# EAGLE design 01 (EAGLE 7.2.0)
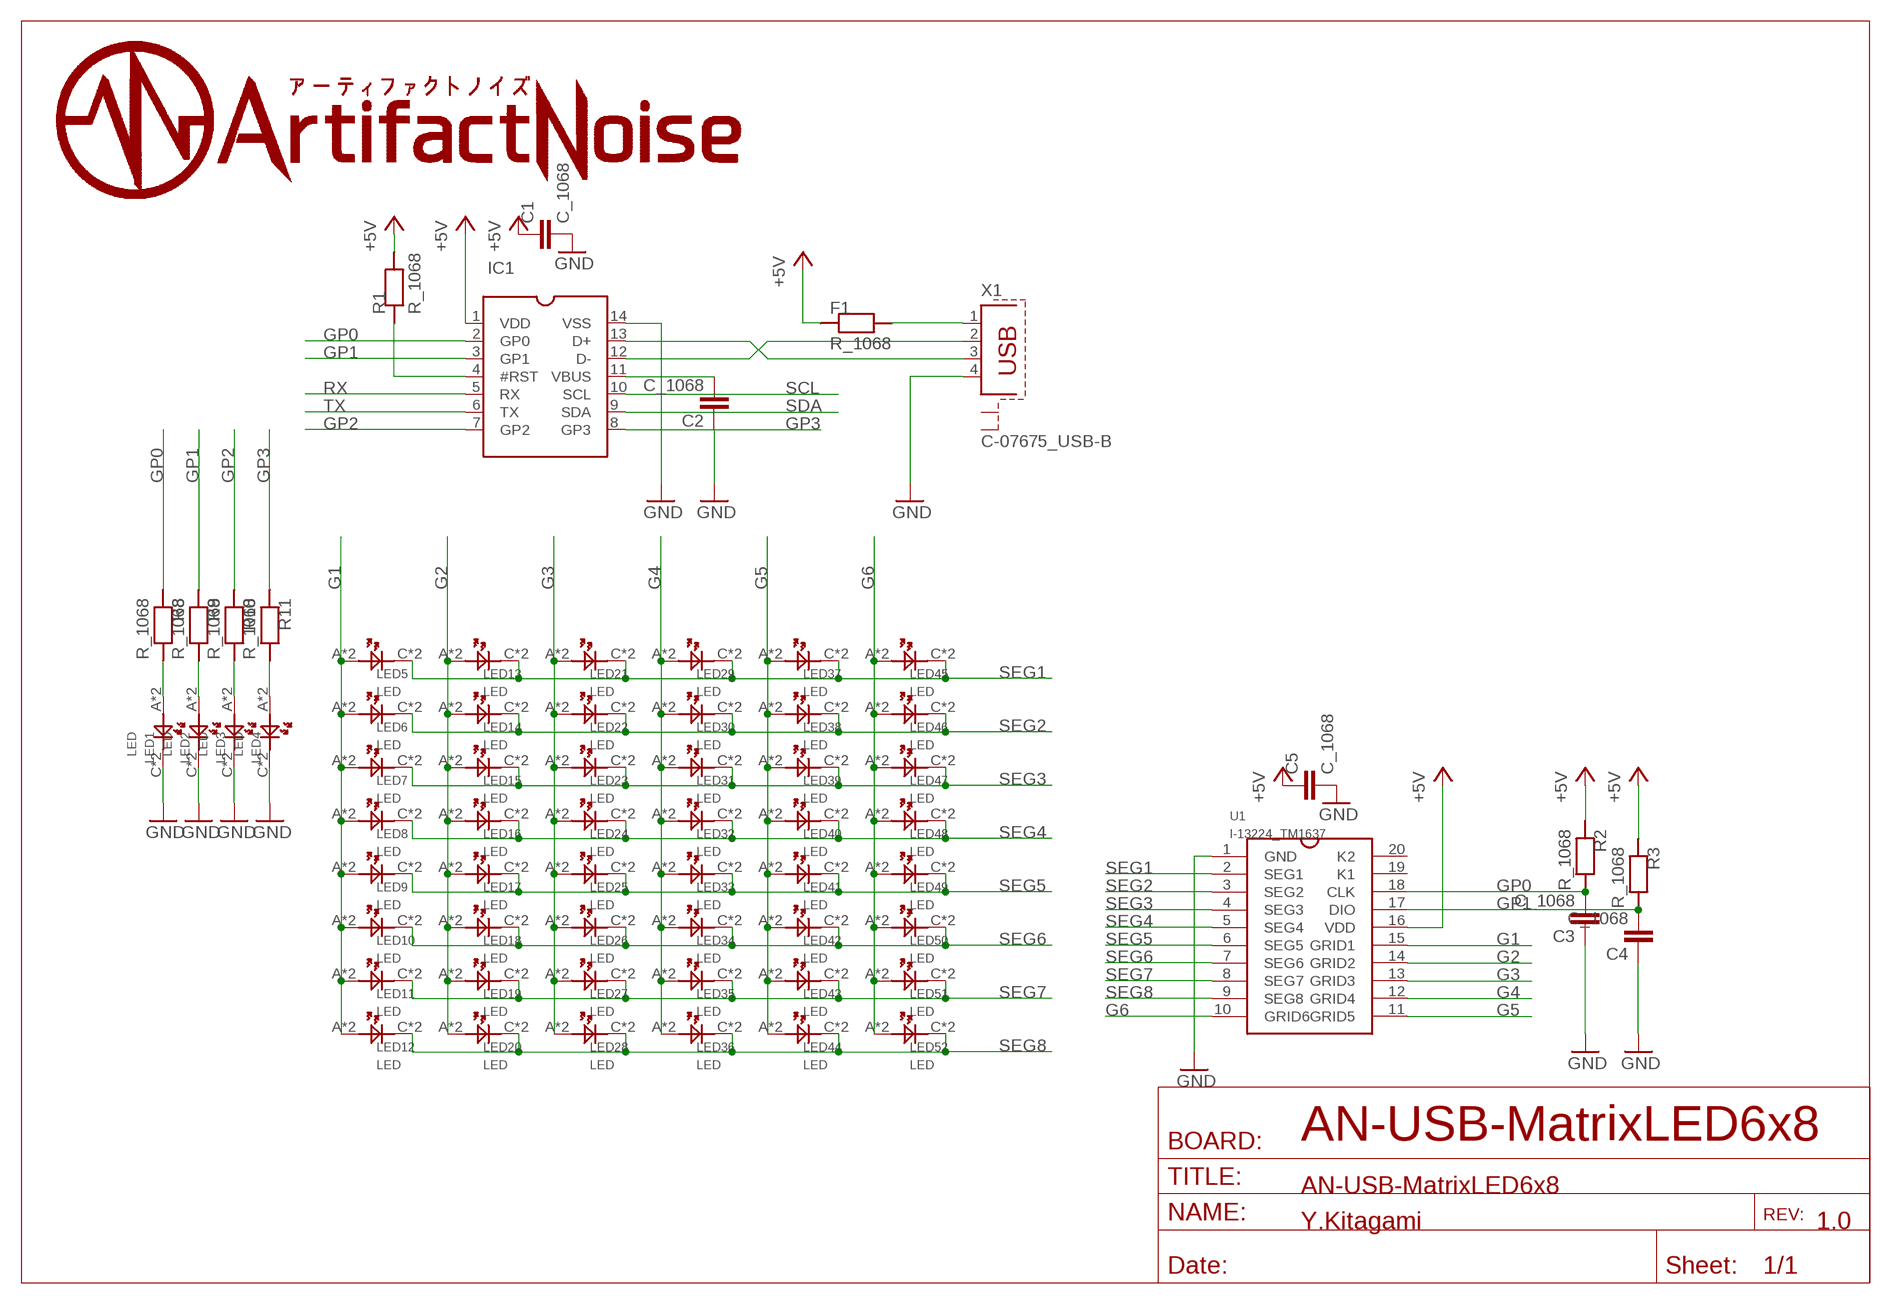
[diagram p0: schematic, sheet 1]

## Parts
C1  C_1068  [C0603]
C2  C_1068  [C0603]
C3  C_1068  [C0603]
C4  C_1068  [C0603]
C5  C_1068  [C0603]
F1  R_1068  [R0603]
IC1  _MCP2221A-I/PS  [SOCKET-14]
LED1  LED  [5MM_LED]
LED2  LED  [5MM_LED]
LED3  LED  [5MM_LED]
LED4  LED  [5MM_LED]
LED5  LED  [5MM_LED]
LED6  LED  [5MM_LED]
LED7  LED  [5MM_LED]
LED8  LED  [5MM_LED]
LED9  LED  [5MM_LED]
LED10  LED  [5MM_LED]
LED11  LED  [5MM_LED]
LED12  LED  [5MM_LED]
LED13  LED  [5MM_LED]
LED14  LED  [5MM_LED]
LED15  LED  [5MM_LED]
LED16  LED  [5MM_LED]
LED17  LED  [5MM_LED]
LED18  LED  [5MM_LED]
LED19  LED  [5MM_LED]
LED20  LED  [5MM_LED]
LED21  LED  [5MM_LED]
LED22  LED  [5MM_LED]
LED23  LED  [5MM_LED]
LED24  LED  [5MM_LED]
LED25  LED  [5MM_LED]
LED26  LED  [5MM_LED]
LED27  LED  [5MM_LED]
LED28  LED  [5MM_LED]
LED29  LED  [5MM_LED]
LED30  LED  [5MM_LED]
LED31  LED  [5MM_LED]
LED32  LED  [5MM_LED]
LED33  LED  [5MM_LED]
LED34  LED  [5MM_LED]
LED35  LED  [5MM_LED]
LED36  LED  [5MM_LED]
LED37  LED  [5MM_LED]
LED38  LED  [5MM_LED]
LED39  LED  [5MM_LED]
LED40  LED  [5MM_LED]
LED41  LED  [5MM_LED]
LED42  LED  [5MM_LED]
LED43  LED  [5MM_LED]
LED44  LED  [5MM_LED]
LED45  LED  [5MM_LED]
LED46  LED  [5MM_LED]
LED47  LED  [5MM_LED]
LED48  LED  [5MM_LED]
LED49  LED  [5MM_LED]
LED50  LED  [5MM_LED]
LED51  LED  [5MM_LED]
LED52  LED  [5MM_LED]
R1  R_1068  [R0603]
R2  R_1068  [R0603]
R3  R_1068  [R0603]
R8  R_1068  [R0603]
R9  R_1068  [R0603]
R10  R_1068  [R0603]
R11  R_1068  [R0603]
U1  I-13224_TM1637  [DIL20]
X1  C-07675_USB-B  [PN61729-S]

## Nets
+5V: C1.1 C1.D1 C5.1 C5.D1 F1.1 F1.D1 IC1.1(VDD) R1.2 R1.D2 R2.1 R2.D1 R3.1 R3.D1 U1.16(VDD)
G1: LED5.A LED5.DA(A) LED6.A LED6.DA(A) LED7.A LED7.DA(A) LED8.A LED8.DA(A) LED9.A LED9.DA(A) LED10.A LED10.DA(A) LED11.A LED11.DA(A) LED12.A LED12.DA(A) U1.15(GRID1)
G2: LED13.A LED13.DA(A) LED14.A LED14.DA(A) LED15.A LED15.DA(A) LED16.A LED16.DA(A) LED17.A LED17.DA(A) LED18.A LED18.DA(A) LED19.A LED19.DA(A) LED20.A LED20.DA(A) U1.14(GRID2)
G3: LED21.A LED21.DA(A) LED22.A LED22.DA(A) LED23.A LED23.DA(A) LED24.A LED24.DA(A) LED25.A LED25.DA(A) LED26.A LED26.DA(A) LED27.A LED27.DA(A) LED28.A LED28.DA(A) U1.13(GRID3)
G4: LED29.A LED29.DA(A) LED30.A LED30.DA(A) LED31.A LED31.DA(A) LED32.A LED32.DA(A) LED33.A LED33.DA(A) LED34.A LED34.DA(A) LED35.A LED35.DA(A) LED36.A LED36.DA(A) U1.12(GRID4)
G5: LED37.A LED37.DA(A) LED38.A LED38.DA(A) LED39.A LED39.DA(A) LED40.A LED40.DA(A) LED41.A LED41.DA(A) LED42.A LED42.DA(A) LED43.A LED43.DA(A) LED44.A LED44.DA(A) U1.11(GRID5)
G6: LED45.A LED45.DA(A) LED46.A LED46.DA(A) LED47.A LED47.DA(A) LED48.A LED48.DA(A) LED49.A LED49.DA(A) LED50.A LED50.DA(A) LED51.A LED51.DA(A) LED52.A LED52.DA(A) U1.10(GRID6)
GND: C1.2 C1.D2 C2.1 C2.D1 C3.1 C3.D1 C4.1 C4.D1 C5.2 C5.D2 IC1.14(VSS) LED1.C LED1.DC(C) LED2.C LED2.DC(C) LED3.C LED3.DC(C) LED4.C LED4.DC(C) U1.1(GND) X1.4
GP0: C3.2 C3.D2 IC1.2(GP0) R2.2 R2.D2 R8.1 R8.D1 U1.18(CLK)
GP1: C4.2 C4.D2 IC1.3(GP1) R3.2 R3.D2 R9.1 R9.D1 U1.17(DIO)
GP2: IC1.7(GP2) R10.1 R10.D1
GP3: IC1.8(GP3) R11.1 R11.D1
N$1: IC1.4(#RST) R1.1 R1.D1
N$2: IC1.13(D+) X1.3
N$3: IC1.12(D-) X1.2
N$4: C2.2 C2.D2 IC1.11(VBUS)
N$5: F1.2 F1.D2 X1.1
N$9: LED1.A LED1.DA(A) R8.2 R8.D2
N$10: LED2.A LED2.DA(A) R9.2 R9.D2
N$11: LED3.A LED3.DA(A) R10.2 R10.D2
N$12: LED4.A LED4.DA(A) R11.2 R11.D2
RX: IC1.5(RX)
SCL: IC1.10(SCL)
SDA: IC1.9(SDA)
SEG1: LED5.C LED5.DC(C) LED13.C LED13.DC(C) LED21.C LED21.DC(C) LED29.C LED29.DC(C) LED37.C LED37.DC(C) LED45.C LED45.DC(C) U1.2(SEG1)
SEG2: LED6.C LED6.DC(C) LED14.C LED14.DC(C) LED22.C LED22.DC(C) LED30.C LED30.DC(C) LED38.C LED38.DC(C) LED46.C LED46.DC(C) U1.3(SEG2)
SEG3: LED7.C LED7.DC(C) LED15.C LED15.DC(C) LED23.C LED23.DC(C) LED31.C LED31.DC(C) LED39.C LED39.DC(C) LED47.C LED47.DC(C) U1.4(SEG3)
SEG4: LED8.C LED8.DC(C) LED16.C LED16.DC(C) LED24.C LED24.DC(C) LED32.C LED32.DC(C) LED40.C LED40.DC(C) LED48.C LED48.DC(C) U1.5(SEG4)
SEG5: LED9.C LED9.DC(C) LED17.C LED17.DC(C) LED25.C LED25.DC(C) LED33.C LED33.DC(C) LED41.C LED41.DC(C) LED49.C LED49.DC(C) U1.6(SEG5)
SEG6: LED10.C LED10.DC(C) LED18.C LED18.DC(C) LED26.C LED26.DC(C) LED34.C LED34.DC(C) LED42.C LED42.DC(C) LED50.C LED50.DC(C) U1.7(SEG6)
SEG7: LED11.C LED11.DC(C) LED19.C LED19.DC(C) LED27.C LED27.DC(C) LED35.C LED35.DC(C) LED43.C LED43.DC(C) LED51.C LED51.DC(C) U1.8(SEG7)
SEG8: LED12.C LED12.DC(C) LED20.C LED20.DC(C) LED28.C LED28.DC(C) LED36.C LED36.DC(C) LED44.C LED44.DC(C) LED52.C LED52.DC(C) U1.9(SEG8)
TX: IC1.6(TX)
Unconnected: U1.19(K1) U1.20(K2) X1.S1 X1.S2

## Notes on the sheet
- AN-USB-MatrixLED6x8
- AN-USB-MatrixLED6x8
- Y.Kitagami | 1.0

## Library data of the parts
C1-C5 = 01:C_1068
F1 R1-R3 R8-R11 = 01:R_1068
IC1 = 01:_MCP2221A-I/P: Dual In Line / Socket
LED1-LED52 = 01:LED
U1 = 01:I-13224_TM1637
X1 = 01:C-07675_USB-B: BERG USB connector; OC_FARNELL: unknown; OC_NEWARK: unknown

## Board
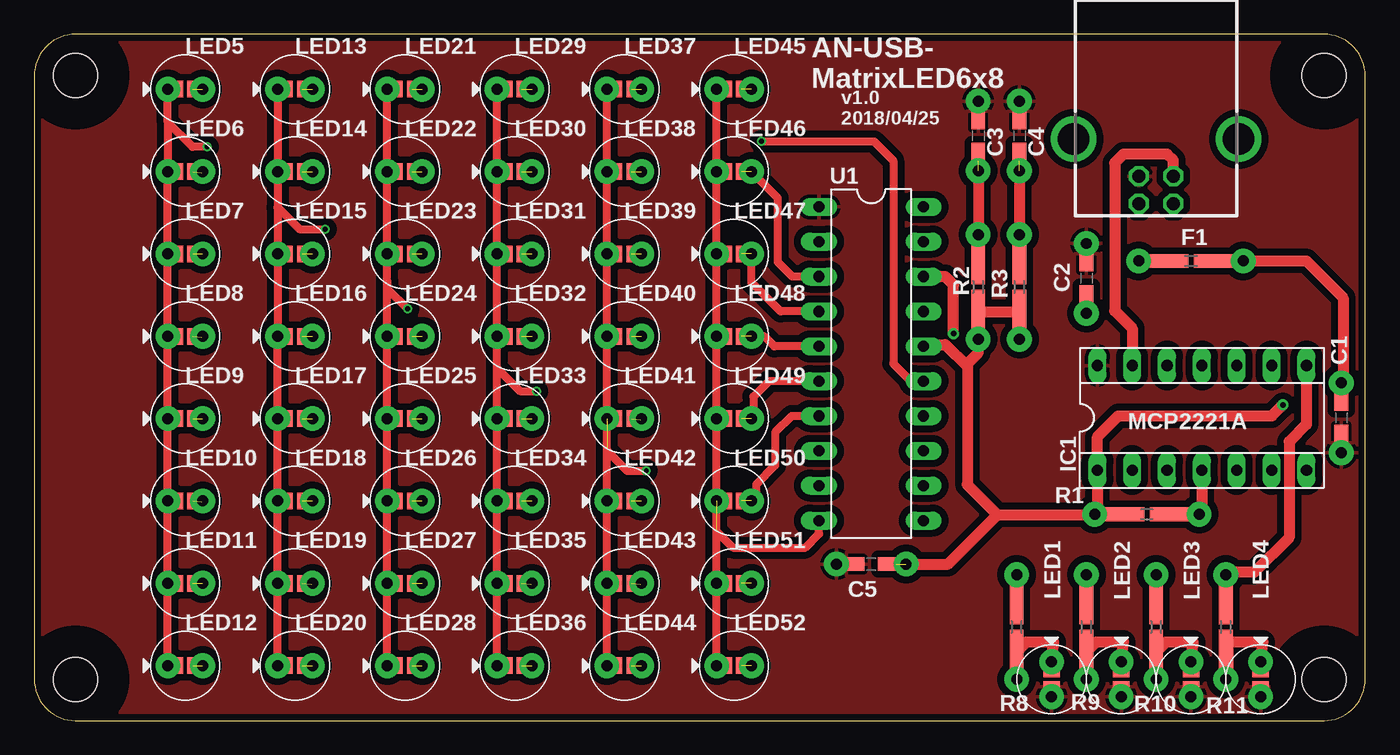
[diagram p1: board, top side]
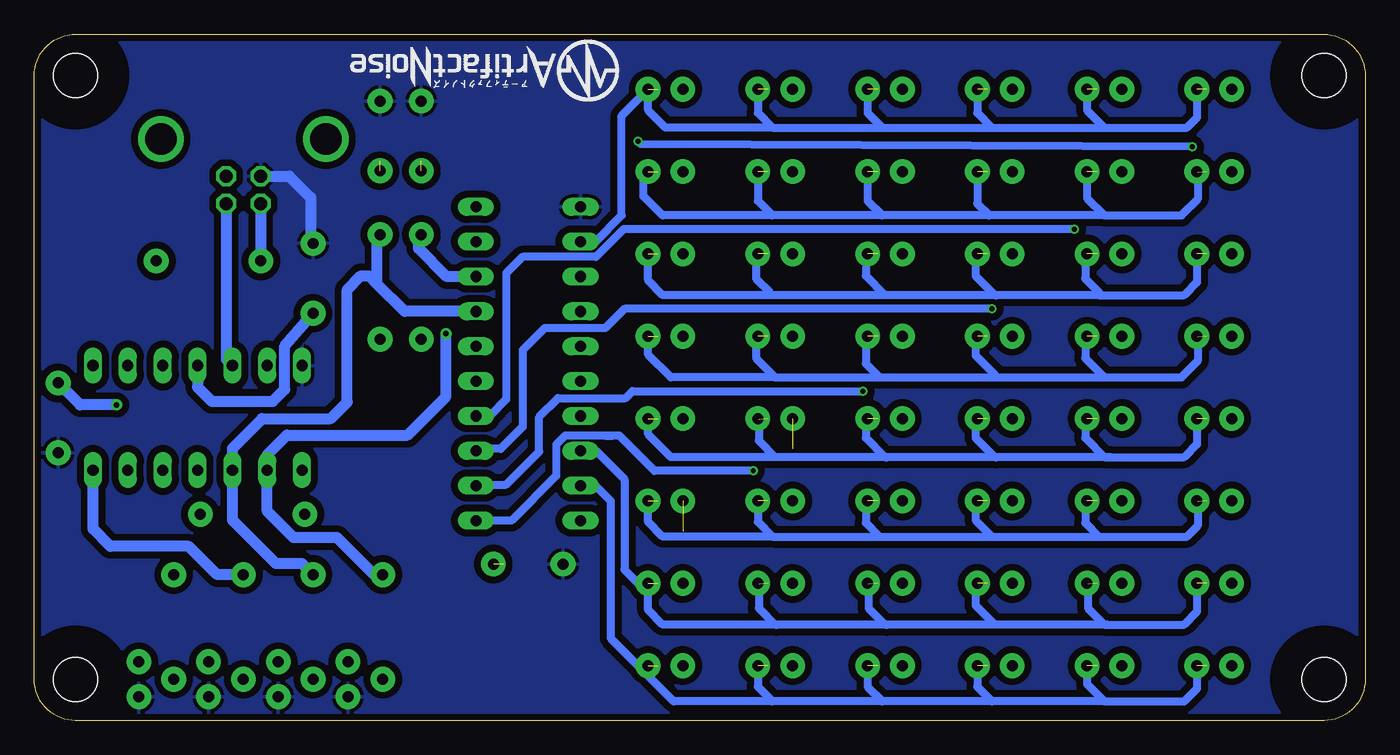
[diagram p2: board, bottom side, seen from below]

Size 97 x 50 mm. Coordinates in mm from the lower left corner, seen from the top.
Outline: 97,3 97,47 arc90 94,50 3,50 arc90 0,47 0,3 arc90 3,0 94,0 arc90 97,3
Copper layers (1*16): Top 0.035mm / dielectric 1.5mm / Bottom 0.035mm
Design rules "SeeedStudio_2layer_DRU_no_angle_20140221a": minimum track width 6mil, minimum drill 12mil, track to track 6mil, track to pad 6mil, pad to pad 6mil, via to via 6mil, smd to smd 0mil, copper to edge 10mil, drill to drill 10mil, minimum pad ring 10mil, minimum via ring 6mil, stop-mask expansion 2mil, vias tented up to drill 25mil, thermal gap 10mil
Holes 3.2 mm at 94,47 3,47 3,3 94,3
tRestrict: area -0.2,43.8 to 6.2,50.2; area -0.2,-0.2 to 6.2,6.2; area 90.8,-0.2 to 97.2,6.2; area 90.8,43.8 to 97.2,50.2
bRestrict: area -0.2,43.8 to 6.2,50.2; area -0.2,-0.2 to 6.2,6.2; area 90.8,-0.2 to 97.2,6.2; area 90.8,43.8 to 97.2,50.2

### Footprints (pad centres in the part's own frame; a part is rotated, then mirrored left to right if it is on the bottom)
C0603 = smd 2.6 x 1: 1 -1.8,0; 2 1.8,0 | drill 0.8 pad 1.8: D1 -2.54,0; D2 2.54,0
R0603 = smd 3.2 x 1: 1 -1.8,0; 2 1.8,0 | drill 0.8 pad 1.8: D1 -3.81,0; D2 3.81,0
SOCKET-14 = drill 0.813 long: 1 -7.62,-3.81; 2 -5.08,-3.81; 3 -2.54,-3.81; 4 0,-3.81; 5 2.54,-3.81; 6 5.08,-3.81; 7 7.62,-3.81; 8 7.62,3.81; 9 5.08,3.81; 10 2.54,3.81; 11 0,3.81; 12 -2.54,3.81; 13 -5.08,3.81; 14 -7.62,3.81
5MM_LED = smd 1.2 x 0.75: A 0,-0.53; C 0,0.53 | drill 0.8 pad 1.8: DA 0,-1.27; DC 0,1.27
DIL20 = drill 0.813 long: 1 -11.43,-3.81; 2 -8.89,-3.81; 3 -6.35,-3.81; 4 -3.81,-3.81; 5 -1.27,-3.81; 6 1.27,-3.81; 7 3.81,-3.81; 8 6.35,-3.81; 9 8.89,-3.81; 10 11.43,-3.81; 11 11.43,3.81; 12 8.89,3.81; 13 6.35,3.81; 14 3.81,3.81; 15 1.27,3.81; 16 -1.27,3.81; 17 -3.81,3.81; 18 -6.35,3.81; 19 -8.89,3.81; 20 -11.43,3.81
PN61729-S = drill 0.95 octagon: 1 1.25,4.71; 2 -1.25,4.71; 3 -1.25,2.71; 4 1.25,2.71 | drill 2.3 pad 2.9: S1 -6.02,0; S2 6.02,0

### Placement (x,y rotation side)
C1  95.26,22.06 270 top
C2  76.68,32.22 270 top
C3  68.8,42.6 270 top
C4  71.8,42.6 270 top
C5  61,11.4 180 top
F1  84.3,33.49 180 top
IC1  85.1,22.06 0 top
LED1  74.14,3.01 180 top
LED2  79.22,3.01 180 top
LED3  84.3,3.01 180 top
LED4  89.38,3.01 180 top
LED5  11,46 270 top
LED6  11,40 270 top
LED7  11,34 270 top
LED8  11,28 270 top
LED9  11,22 270 top
LED10  11,16 270 top
LED11  11,10 270 top
LED12  11,4 270 top
LED13  19,46 270 top
LED14  19,40 270 top
LED15  19,34 270 top
LED16  19,28 270 top
LED17  19,22 270 top
LED18  19,16 270 top
LED19  19,10 270 top
LED20  19,4 270 top
LED21  27,46 270 top
LED22  27,40 270 top
LED23  27,34 270 top
LED24  27,28 270 top
LED25  27,22 270 top
LED26  27,16 270 top
LED27  27,10 270 top
LED28  27,4 270 top
LED29  35,46 270 top
LED30  35,40 270 top
LED31  35,34 270 top
LED32  35,28 270 top
LED33  35,22 270 top
LED34  35,16 270 top
LED35  35,10 270 top
LED36  35,4 270 top
LED37  43,46 270 top
LED38  43,40 270 top
LED39  43,34 270 top
LED40  43,28 270 top
LED41  43,22 270 top
LED42  43,16 270 top
LED43  43,10 270 top
LED44  43,4 270 top
LED45  51,46 270 top
LED46  51,40 270 top
LED47  51,34 270 top
LED48  51,28 270 top
LED49  51,22 270 top
LED50  51,16 270 top
LED51  51,10 270 top
LED52  51,4 270 top
R1  81.09,15.04 180 top
R2  68.8,31.6 90 top
R3  71.8,31.6 90 top
R8  71.6,6.82 270 top
R9  76.68,6.82 270 top
R10  81.76,6.82 270 top
R11  86.84,6.82 270 top
U1  61,26 270 top
U$1  [AN-LOGO2]  54.4,49.6 180 bottom
X1  81.76,42.38 180 top

### Tracks (layer width: path | path; a pad name or v marks a point on that pad's centre or on a via)
+5V  (via drill 0.4 pad 0.8)  (1 unrouted)
  Top 0.406: R1.2 R1.D2
  Top 0.8: C1.D1 C1.1 | U1.16 64.94,27.4 66.4,27.4 68,25.8 | 95.2,24.66 C1.D1 | 68,25.8 68,17.2 70.2,15 | 70.2,15 77.24,15 R1.D2 77.48,15.24 IC1.1 77.48,20.68 79,22.2 90.2,22.2 v91,23 | 88,33.4 87.91,33.49 F1.1 F1.D1 92.71,33.49 95.4,30.8 95.4,24.74 C1.D1 | 68,25.8 68,26 68.8,26.8 R2.D1 R2.1 R3.1 R3.D1 | C5.D1 66.6,11.4 70.2,15
  Bottom 0.8: v91,23 93.66,23 C1.D1
G1  (via drill 0.35)
  Top 0.6: LED12.DA LED11.DA LED10.DA LED9.DA LED8.DA LED7.DA LED6.DA 9.73,43.6 | 9.73,43.6 LED5.DA | v53,42.2 61.2,42.2 62.6,40.8 62.6,26 64,24.6 64.68,24.6 U1.15 | v12.6,41.8 11.53,41.8 9.73,43.6
  Bottom 0.6: v12.6,41.8 52.8,42 v53,42.2
G2  (via drill 0.35)
  Top 0.6: LED20.DA LED19.DA LED18.DA LED17.DA LED16.DA LED15.DA 17.73,37.4 | LED13.DA LED14.DA 17.73,37.4 | 17.73,37.4 19.33,35.8 v21.2,35.8
  Bottom 0.6: v21.2,35.8 54.05,35.8 56.07,33.78 61.42,33.78 62.6,32.6 62.6,23.4 63.81,22.19 U1.14
G3  (via drill 0.35)
  Top 0.6: LED28.DA LED27.DA LED26.DA LED25.DA LED24.DA 25.73,32 | 25.73,32 LED23.DA LED22.DA LED21.DA | 25.73,32 25.73,31.47 v27.2,30
  Bottom 0.6: v27.2,30 54,30 55.4,28.6 59.8,28.6 61.4,27 61.4,21.4 63,19.8 64.66,19.8 U1.13
G4  (via drill 0.35)
  Top 0.6: LED36.DA LED35.DA LED34.DA LED33.DA 33.73,25.6 | 33.73,25.6 LED32.DA LED31.DA LED30.DA LED29.DA | 33.73,25.6 33.8,25.6 35.4,24 v36.6,24
  Bottom 0.6: v36.6,24 53.4,24 53.9,23.5 58.83,23.5 60.2,22.14 60.2,19.6 62.6,17.2 64.72,17.2 U1.12
G5  (via drill 0.35)  (1 unrouted)
  Top 0.6: LED44.DA LED43.DA LED42.DA LED41.DA LED40.DA LED39.DA LED38.DA LED37.DA | 41.73,19.8 41.73,19.67 43.2,18.2 v44.6,18.2
  Bottom 0.6: v44.6,18.2 51.8,18.2 54.36,20.76 55.4,20.76 | 55.4,20.76 54.84,20.76 | 55.4,20.76 58.31,20.76 58.96,20.11 58.96,17.84 62.23,14.57 U1.11
G6  (1 unrouted)
  Top 0.6: LED52.DA LED51.DA LED50.DA LED49.DA LED48.DA LED47.DA LED46.DA LED45.DA | 49.73,13.8 50.93,12.6 56.2,12.6 57.2,13.6 U1.10
GND
  Top 0.8: LED4.C LED4.DC
  Bottom 0.8: X1.4 78.42,39.67 76.84,38.1 76.84,34.92 C2.D1
  pour Top (isolate 0.5): 97.27,0.2 -0.8,-0.8 -0.8,51.27 98.27,51.27
  pour Bottom (isolate 0.5): 97.27,0.2 -0.8,-0.8 -0.8,51.27 98.27,51.27
GP0  (via drill 0.4 pad 0.8)  (1 unrouted)
  Top 0.406: R8.1 R8.D1
  Top 0.8: v67,28.2 67,31.75 66.4,32.35 U1.18 | C3.D2 68.8,36 R2.D2 R2.2
  Bottom 0.8: R8.D1 72.23,10.63 74.94,13.34 78.11,13.34 80.02,15.24 IC1.2 80.02,19.38 78.6,20.8 69.8,20.8 67,23.6 v67,28.2 | U1.18 66.95,32.35 69,34.4 69,35.21 R2.D2
GP1  (1 unrouted)
  Top 0.406: R9.1 R9.D1
  Top 0.8: C4.D2 R3.D2 R3.2
  Bottom 0.8: R9.D1 77.48,11.43 79.39,11.43 82.56,14.61 IC1.3 82.56,19.84 80.4,22 75.4,22 74.2,23.2 74.2,31.4 73.2,32.4 72.6,32.4 72,31.8 | 72,31.8 72,35.21 R3.D2 | U1.17 70.01,29.81 72,31.8
GP2
  Top 0.406: R10.1 R10.D1
  Bottom 0.8: R10.D1 83.67,10.63 85.73,12.7 91.45,12.7 92.72,13.97 IC1.7
GP3
  Top 0.406: R11.1 R11.D1
  Top 0.8: IC1.8 92.72,21.59 91.45,20.32 91.45,13.34 88.91,10.79 87,10.79 R11.D1
N$1
  Top 0.406: R1.1 R1.D1
  Top 0.8: IC1.4 85.1,15.24 R1.D1
N$2
  Top 0.8: X1.3 83.01,40.83 82.56,41.27 79.39,41.27 78.75,40.64 78.75,29.84 80.02,28.57 IC1.13
N$3
  Bottom 0.8: X1.2 83.01,26.32 IC1.12
N$4
  Top 0.406: C2.D2 C2.2
  Bottom 0.8: IC1.11 85.1,24.3 84.06,23.26 79.62,23.26 78.75,24.13 78.75,27.3 C2.D2
N$5
  Top 0.8: F1.D2 F1.2
  Bottom 0.8: X1.1 80.51,33.51 F1.D2
N$9
  Top 0.8: LED1.A LED1.DA 74.31,5.71 72.3,5.71 R8.2 R8.D2
N$10
  Top 0.8: LED2.A LED2.DA 79.39,5.71 77.38,5.71 R9.2 R9.D2
N$11
  Top 0.8: LED3.A LED3.DA 84.47,5.71 82.45,5.71 R10.2 81.76,3.98 81.92,3.17 R10.D2
N$12
  Top 0.8: LED4.A LED4.DA 89.55,5.71 87,5.71 87,4.86 | 87,4.86 87,3.17 R11.D2 | 87,4.86 R11.2
SEG1  (6 unrouted)
  Bottom 0.6: U1.2 56.11,34.89 54.2,36.8 54.2,44.07 LED45.DC 52.27,44.47 51,43.2 43.2,43.2 | LED5.DC 12.27,43.93 13,43.2 19,43.2 | 27.2,43.2 19,43.2 | 35.2,43.2 27.2,43.2 | 43.2,43.2 35.2,43.2 | LED13.DC 20.27,44.47 19,43.2 | LED21.DC 28.27,44.27 27.2,43.2 | LED29.DC 36.27,44.27 35.2,43.2 | LED37.DC 44.27,44.27 43.2,43.2
SEG2  (6 unrouted)
  Top 0.6: U1.3 55.25,32.35 54.2,33.4 54.2,38.07 LED46.DC
  Bottom 0.6: LED6.DC 12.2,39.93 12.2,38 13.4,36.8 19,36.8 | 35.2,36.8 43.2,36.8 | 27.4,36.8 35.2,36.8 | 19,36.8 27.4,36.8 | 43.2,36.8 51.2,36.8 52.6,38.2 52.6,39.67 LED46.DC | LED38.DC 44.27,37.87 43.2,36.8 | LED30.DC 36.27,37.87 35.2,36.8 | LED22.DC 28.27,37.67 27.4,36.8 | LED14.DC 20.27,38.07 19,36.8
SEG3  (6 unrouted)
  Top 0.6: U1.4 54.39,29.81 52.27,31.93 LED47.DC
  Bottom 0.6: LED7.DC 12.27,31.93 13.2,31 19.4,31 | 35,31 43.4,31 | 26.8,31 35,31 | 19.4,31 26.8,31 | 43.4,31 51.2,31 52.27,32.07 LED47.DC | LED39.DC 44.4,33.87 44.4,32.2 43.4,31.2 43.4,31 | LED31.DC 36.4,33.87 36.4,32.4 35,31 | LED23.DC 28.4,33.87 28.4,32.4 27,31 26.8,31 | LED15.DC 20.4,33.87 20.4,32.2 19.4,31.2 19.4,31
SEG4  (6 unrouted)
  Top 0.6: U1.5 53.93,27.27 53.2,28 LED48.DC
  Bottom 0.6: LED8.DC 12.2,27.93 12.2,26.2 13.4,25 19,25 | 27,25 19,25 | 35.4,25 27,25 | 43,25 35.4,25 | 43,25 50.6,25 52.27,26.67 LED48.DC | LED16.DC 20.4,27.87 20.4,26.4 19,25 | LED24.DC 28.4,27.87 28.4,26.6 27,25.2 27,25 | LED32.DC 36.4,27.87 36.4,26 35.4,25 | LED40.DC 44.4,27.87 44.4,26.4 43,25
SEG5  (6 unrouted)
  Top 0.6: U1.6 53.53,24.73 52.4,23.6 52.4,22.13 LED49.DC
  Bottom 0.6: LED9.DC 12.27,20.13 13.2,19.2 18.6,19.2 | 34.8,19.2 43,19.2 | 26.8,19.2 34.8,19.2 | 18.6,19.2 26.8,19.2 | 43,19.2 50.6,19.2 52.27,20.87 LED49.DC | LED41.DC 44.2,21.93 44.2,20.4 43,19.2 | LED33.DC 36.4,21.87 36.4,20.6 35,19.2 34.8,19.2 | LED25.DC 28.4,21.87 28.4,20.6 27,19.2 26.8,19.2 | LED17.DC 20.4,21.87 20.4,20.6 19,19.2 18.6,19.2
SEG6  (6 unrouted)
  Top 0.6: U1.7 55.19,22.19 54,21 54,18.6 52.6,17.2 52.6,16.33 LED50.DC
  Bottom 0.6: LED10.DC 12.2,15.93 12.2,14.2 13,13.4 19.4,13.4 | 27.2,13.4 19.4,13.4 | 35.4,13.4 27.2,13.4 | 43.2,13.4 35.4,13.4 | 43.2,13.4 51.2,13.4 52.27,14.47 LED50.DC | LED18.DC 20.4,15.87 20.4,14.4 19.4,13.4 | LED26.DC 28.4,15.87 28.4,14.6 27.2,13.4 | LED34.DC 36.4,15.87 36.4,14.4 35.4,13.4 | LED42.DC 44.27,14.47 43.2,13.4
SEG7  (6 unrouted)
  Bottom 0.6: U1.8 56.05,19.65 54,17.6 54,11 52.6,9.6 52.6,9.67 LED51.DC 52.27,8.07 51.2,7 42.8,7 | LED11.DC 12.27,7.93 13.2,7 18.8,7 | 34.8,7 42.8,7 | 27,7 34.8,7 | 18.8,7 27,7 | LED43.DC 44.2,9.93 44.2,8.2 43,7 42.8,7 | LED35.DC 36.2,9.93 36.2,8.2 35,7 34.8,7 | LED27.DC 28.4,9.87 28.4,8.4 27,7 | LED19.DC 20.2,9.93 20.2,8.2 19,7 18.8,7
SEG8  (6 unrouted)
  Bottom 0.6: U1.9 56.11,17.11 55,16 55,6 52.8,3.8 52.47,3.8 52.44,3.83 | 52.44,3.83 LED52.DC | LED12.DC 12.27,2.33 13.2,1.4 19,1.4 | 35.2,1.4 43.2,1.4 | 27.2,1.4 35.2,1.4 | 19,1.4 27.2,1.4 | 43.2,1.4 50.4,1.4 52.2,3.2 52.2,3.6 52.44,3.83 | LED44.DC 44.27,2.47 43.2,1.4 | LED36.DC 36.27,2.47 35.2,1.4 | LED28.DC 28.27,2.47 27.2,1.4 | LED20.DC 20.27,2.67 19,1.4

### Text on the board
tPlace: AN-USB- / MatrixLED6x8 | v1.0 / 2018/04/25 | MCP2221A